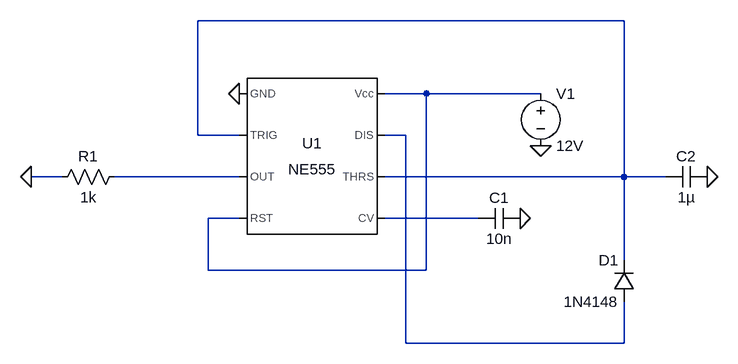
[diagram p0: schematic Draft3.asc]
Draft3.asc, the LTspice schematic file:
Version 4
SHEET 1 880 680
WIRE 720 -80 64 -80
WIRE 416 32 352 32
WIRE 592 32 416 32
WIRE 64 96 64 -80
WIRE 128 96 64 96
WIRE 384 96 352 96
WIRE -144 160 -192 160
WIRE 128 160 -64 160
WIRE 720 160 720 -80
WIRE 720 160 352 160
WIRE 784 160 720 160
WIRE 128 224 80 224
WIRE 496 224 352 224
WIRE 720 288 720 160
WIRE 80 304 80 224
WIRE 416 304 416 32
WIRE 416 304 80 304
WIRE 384 416 384 96
WIRE 720 416 720 352
WIRE 720 416 384 416
FLAG 592 112 0
FLAG -192 160 0
FLAG 128 32 0
FLAG 560 224 0
FLAG 848 160 0
SYMBOL Misc\\NE555 240 128 R0
SYMATTR InstName U1
SYMBOL voltage 592 16 R0
WINDOW 123 0 0 Left 0
WINDOW 39 0 0 Left 0
SYMATTR InstName V1
SYMATTR Value 12V
SYMBOL res -48 144 R90
WINDOW 0 0 56 VBottom 2
WINDOW 3 32 56 VTop 2
SYMATTR InstName R1
SYMATTR Value 1k
SYMBOL cap 560 208 R90
WINDOW 0 0 32 VBottom 2
WINDOW 3 32 32 VTop 2
SYMATTR InstName C1
SYMATTR Value 10n
SYMBOL diode 736 352 R180
WINDOW 0 24 64 Left 2
WINDOW 3 24 0 Left 2
SYMATTR InstName D1
SYMATTR Value 1N4148
SYMBOL cap 784 176 R270
WINDOW 0 32 32 VTop 2
WINDOW 3 0 32 VBottom 2
SYMATTR InstName C2
SYMATTR Value 1µ

The netlist it stands for:
* Draft3.asc
XU1 0 N001 N004 N002 N005 N001 N003 N002 NE555  ; pins GND TRIG OUT RST CV THRS DIS Vcc
V1 N002 0 12V
R1 N004 0 1k
C1 0 N005 10n
D1 N003 N001 1N4148
C2 N001 0 1µ
.model D D
.lib standard.dio
.lib NE555.sub
.backanno
.end